# Altium schematic sheet Measurement.SchDoc: Measurement
size A3; DocumentNumber: 11; SheetNumber: 11; SheetTotal: 19
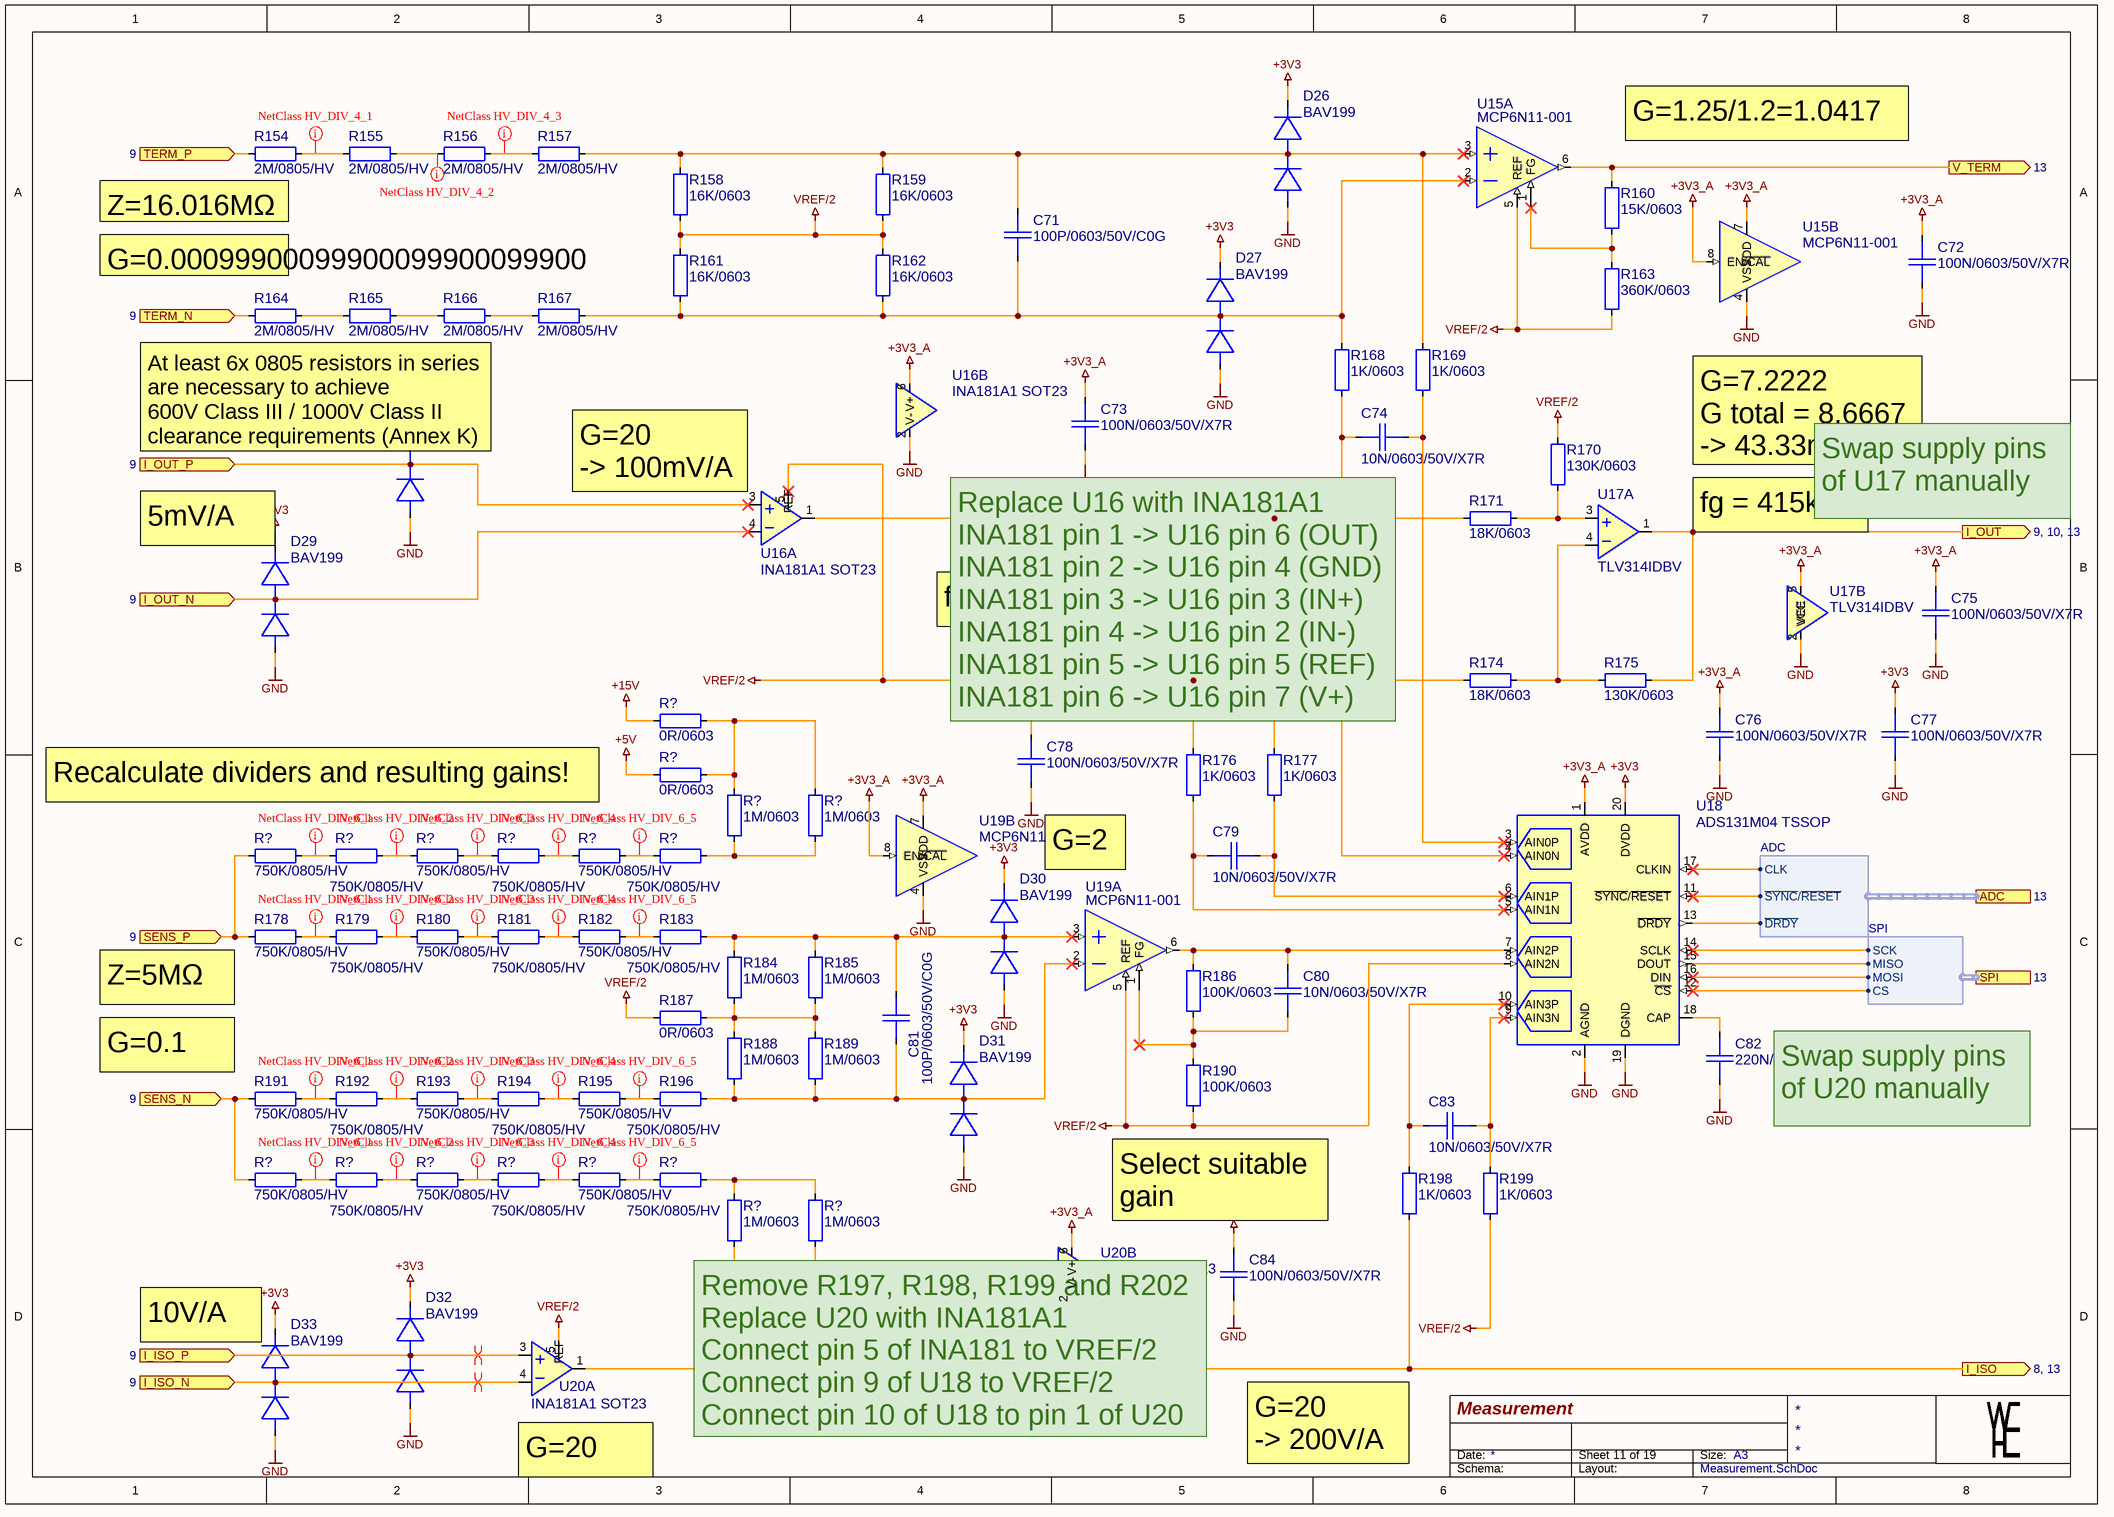
[diagram p0: Measurement.SchDoc]

## Parts
(Parts that share a designator on the sheet are numbered #1, #2 ... from top to bottom, then left to right.)
C71  100P/0603/50V/C0G  [CAP0603_C0G]
C72  100N/0603/50V/X7R  [CAP0603_X7R]
C73  100N/0603/50V/X7R  [CAP0603_X7R]
C74  10N/0603/50V/X7R  [CAP0603_X7R]
C75  100N/0603/50V/X7R  [CAP0603_X7R]
C76  100N/0603/50V/X7R  [CAP0603_X7R]
C77  100N/0603/50V/X7R  [CAP0603_X7R]
C78  100N/0603/50V/X7R  [CAP0603_X7R]
C79  10N/0603/50V/X7R  [CAP0603_X7R]
C80  10N/0603/50V/X7R  [CAP0603_X7R]
C81  100P/0603/50V/C0G  [CAP0603_C0G]
C82  220N/0603/25V/X7R  [CAP0603_X7R]
C83  10N/0603/50V/X7R  [CAP0603_X7R]
C84  100N/0603/50V/X7R  [CAP0603_X7R]
D26  BAV199  [SOT2395P280X125-3-SE]
D27  BAV199  [SOT2395P280X125-3-SE]
D28  BAV199  [SOT2395P280X125-3-SE]
D29  BAV199  [SOT2395P280X125-3-SE]
D30  BAV199  [SOT2395P280X125-3-SE]
D31  BAV199  [SOT2395P280X125-3-SE]
D32  BAV199  [SOT2395P280X125-3-SE]
D33  BAV199  [SOT2395P280X125-3-SE]
R154  2M/0805/HV  [R0805-0.50-HV-WW]
R155  2M/0805/HV  [R0805-0.50-HV-WW]
R156  2M/0805/HV  [R0805-0.50-HV-WW]
R157  2M/0805/HV  [R0805-0.50-HV-WW]
R158  16K/0603  [R0603-0.40-WW]
R159  16K/0603  [R0603-0.40-WW]
R160  15K/0603  [R0603-0.40-WW]
R161  16K/0603  [R0603-0.40-WW]
R162  16K/0603  [R0603-0.40-WW]
R163  360K/0603  [R0603-0.40-WW]
R164  2M/0805/HV  [R0805-0.50-HV-WW]
R165  2M/0805/HV  [R0805-0.50-HV-WW]
R166  2M/0805/HV  [R0805-0.50-HV-WW]
R167  2M/0805/HV  [R0805-0.50-HV-WW]
R168  1K/0603  [R0603-0.40-WW]
R169  1K/0603  [R0603-0.40-WW]
R170  130K/0603  [R0603-0.40-WW]
R171  18K/0603  [R0603-0.40-WW]
R174  18K/0603  [R0603-0.40-WW]
R175  130K/0603  [R0603-0.40-WW]
R176  1K/0603  [R0603-0.40-WW]
R177  1K/0603  [R0603-0.40-WW]
R178  750K/0805/HV  [R0805-0.50-HV-WW]
R179  750K/0805/HV  [R0805-0.50-HV-WW]
R180  750K/0805/HV  [R0805-0.50-HV-WW]
R181  750K/0805/HV  [R0805-0.50-HV-WW]
R182  750K/0805/HV  [R0805-0.50-HV-WW]
R183  750K/0805/HV  [R0805-0.50-HV-WW]
R184  1M/0603  [R0603-0.40-WW]
R185  1M/0603  [R0603-0.40-WW]
R186  100K/0603  [R0603-0.40-WW]
R187  0R/0603  [R0603-0.40-WW]
R188  1M/0603  [R0603-0.40-WW]
R189  1M/0603  [R0603-0.40-WW]
R190  100K/0603  [R0603-0.40-WW]
R191  750K/0805/HV  [R0805-0.50-HV-WW]
R192  750K/0805/HV  [R0805-0.50-HV-WW]
R193  750K/0805/HV  [R0805-0.50-HV-WW]
R194  750K/0805/HV  [R0805-0.50-HV-WW]
R195  750K/0805/HV  [R0805-0.50-HV-WW]
R196  750K/0805/HV  [R0805-0.50-HV-WW]
R198  1K/0603  [R0603-0.40-WW]
R199  1K/0603  [R0603-0.40-WW]
R?#1  0R/0603  [R0603-0.40-WW]
R?#2  0R/0603  [R0603-0.40-WW]
R?#3  1M/0603  [R0603-0.40-WW]
R?#4  1M/0603  [R0603-0.40-WW]
R?#5  750K/0805/HV  [R0805-0.50-HV-WW]
R?#6  750K/0805/HV  [R0805-0.50-HV-WW]
R?#7  750K/0805/HV  [R0805-0.50-HV-WW]
R?#8  750K/0805/HV  [R0805-0.50-HV-WW]
R?#9  750K/0805/HV  [R0805-0.50-HV-WW]
R?#10  750K/0805/HV  [R0805-0.50-HV-WW]
R?#11  750K/0805/HV  [R0805-0.50-HV-WW]
R?#12  750K/0805/HV  [R0805-0.50-HV-WW]
R?#13  750K/0805/HV  [R0805-0.50-HV-WW]
R?#14  750K/0805/HV  [R0805-0.50-HV-WW]
R?#15  750K/0805/HV  [R0805-0.50-HV-WW]
R?#16  750K/0805/HV  [R0805-0.50-HV-WW]
R?#17  1M/0603  [R0603-0.40-WW]
R?#18  1M/0603  [R0603-0.40-WW]
U15  MCP6N11-001  [SOP127P600X155-8-SW]  (parts A,B of 2)
U16  INA181A1 SOT23  [SOT2395P280X125-6-SE]  (parts A,B of 2)
U17  TLV314IDBV  [SOT2395P280X125-5-NW]  (parts A,B of 2)
U18  ADS131M04 TSSOP  [SOP065P640X120-20NW]
U19  MCP6N11-001  [SOP127P600X155-8-SW]  (parts A,B of 2)
U20  INA181A1 SOT23  [SOT2395P280X125-6-SE]  (parts A,B of 2)

## Ports
ADC (harness ADC, see 13), I_ISO (out, see 8, 13), I_ISO_N (in, see 9), I_ISO_P (in, see 9), I_OUT (out, see 9, 10, 13), I_OUT_N (in, see 9), I_OUT_P (in, see 9), SENS_N (in, see 9), SENS_P (in, see 9), SPI (harness SPI, see 13), TERM_N (in, see 9), TERM_P (in, see 9), V_TERM (out, see 13)

## Harnesses
ADC: CLK, ~{SYNC}/~{RESET}, ~{DRDY}
SPI: SCK, MISO, MOSI, CS

## Nets
+3V3: C77.1 D26.2(K2) D27.2(K2) D28.2(K2) D29.2(K2) D30.2(K2) D31.2(K2) D32.2(K2) D33.2(K2) U18.20(DVDD)
+3V3_A: C72.1 C73.1 C75.1 C76.1 C78.1 C84.1 U15.7(VDD) U15.8(EN/~{CAL}) U16.6(V+) U17.5(VCC) U18.1(AVDD) U19.7(VDD) U19.8(EN/~{CAL}) U20.6(V+)
+5V: R?#2.2
+15V: R?#1.2
GND: C72.2 C73.2 C75.2 C76.2 C77.2 C78.2 C82.2 C84.2 D26.1(A1) D27.1(A1) D28.1(A1) D29.1(A1) D30.1(A1) D31.1(A1) D32.1(A1) D33.1(A1) R?#17.2 R?#18.2 U15.4(VSS) U16.2(V-) U17.2(VEE) U18.2(AGND) U18.19(DGND) U19.4(VSS) U20.2(V-)
VREF/2: R158.2 R159.2 R161.1 R162.1 R163.2 R170.2 R174.1 R176.1 R187.2 R190.2 R199.2 U15.5(REF) U16.5(REF) U18.8(AIN2N) U19.5(REF) U20.5(REF)
I_ISO: R198.2 U20.1(OUT) ; port I_ISO
I_ISO_N: D33.3(K1/A2) U20.4(IN-) ; port I_ISO_N
I_ISO_P: D32.3(K1/A2) U20.3(IN+) ; port I_ISO_P
I_OUT: R175.2 U17.1(OUT) ; port I_OUT
I_OUT_N: D29.3(K1/A2) U16.4(IN-) ; port I_OUT_N
I_OUT_P: D28.3(K1/A2) U16.3(IN+) ; port I_OUT_P
SENS_N: R191.1 R?#11.1 ; port SENS_N
SENS_P: R178.1 R?#5.1 ; port SENS_P
TERM_N: R164.1 ; port TERM_N
TERM_P: R154.1 ; port TERM_P
V_TERM: R160.1 U15.6(Out) ; port V_TERM
NetC71_1: C71.1 D26.3(K1/A2) R157.1 R158.1 R159.1 R169.1 U15.3(+)
NetC71_2: C71.2 D27.3(K1/A2) R161.2 R162.2 R167.2 R168.1 U15.2(-)
NetC74_1: C74.1 R168.2 U18.4(AIN0N)
NetC74_2: C74.2 R169.2 U18.3(AIN0P)
NetC79_1: C79.1 R176.2 U18.5(AIN1N)
NetC79_2: C79.2 R177.2 U18.6(AIN1P)
NetC80_1: C80.1 R186.1 U18.7(AIN2P) U19.6(Out)
NetC80_2: C80.2 R186.2 R190.1 U19.1(FG)
NetC81_1: C81.1 D30.3(K1/A2) R183.2 R184.1 R185.1 U19.3(+)
NetC81_2: C81.2 D31.3(K1/A2) R188.2 R189.2 R196.2 U19.2(-)
NetC82_1: C82.1 U18.18(CAP)
NetC83_1: C83.1 R198.1 U18.10(AIN3P)
NetC83_2: C83.2 R199.1 U18.9(AIN3N)
NetR154_2: R154.2 R155.2
NetR155_1: R155.1 R156.1
NetR156_2: R156.2 R157.2
NetR160_2: R160.2 R163.1 U15.1(FG)
NetR164_2: R164.2 R165.1
NetR165_2: R165.2 R166.1
NetR166_2: R166.2 R167.1
NetR170_1: R170.1 R171.2 U17.3(IN+)
NetR171_1: R171.1 R177.1 U16.1(OUT)
NetR174_2: R174.2 R175.1 U17.4(IN-)
NetR178_2: R178.2 R179.1
NetR179_2: R179.2 R180.1
NetR180_2: R180.2 R181.1
NetR181_2: R181.2 R182.1
NetR182_2: R182.2 R183.1
NetR184_2: R184.2 R185.2 R187.1 R188.1 R189.1
NetR191_2: R191.2 R192.1
NetR192_2: R192.2 R193.1
NetR193_2: R193.2 R194.1
NetR194_2: R194.2 R195.1
NetR195_2: R195.2 R196.1
NetR?#1_1: R?#1.1 R?#2.1 R?#3.1 R?#4.1
NetR?#3_2: R?#3.2 R?#4.2 R?#10.2
NetR?#5_2: R?#5.2 R?#6.1
NetR?#6_2: R?#6.2 R?#7.1
NetR?#7_2: R?#7.2 R?#8.1
NetR?#8_2: R?#8.2 R?#9.1
NetR?#9_2: R?#9.2 R?#10.1
NetR?#11_2: R?#11.2 R?#12.1
NetR?#12_2: R?#12.2 R?#13.1
NetR?#13_2: R?#13.2 R?#14.1
NetR?#14_2: R?#14.2 R?#15.1
NetR?#15_2: R?#15.2 R?#16.1
NetR?#16_2: R?#16.2 R?#17.1 R?#18.1
NetU18_11: U18.11(~{SYNC}/~{RESET}) ; port ADC.~{SYNC}/~{RESET}
NetU18_12: U18.12(~{CS}) ; port SPI.CS
NetU18_13: U18.13(~{DRDY}) ; port ADC.~{DRDY}
NetU18_14: U18.14(SCLK) ; port SPI.SCK
NetU18_15: U18.15(DOUT) ; port SPI.MISO
NetU18_16: U18.16(DIN) ; port SPI.MOSI
NetU18_17: U18.17(CLKIN) ; port ADC.CLK

## Layout directives
net class HV_DIV_4_1: NetR154_2
net class HV_DIV_4_2: NetR155_1
net class HV_DIV_4_3: NetR156_2
net class HV_DIV_6_1: NetR178_2, NetR191_2, NetR?#5_2, NetR?#11_2
net class HV_DIV_6_2: NetR179_2, NetR192_2, NetR?#6_2, NetR?#12_2
net class HV_DIV_6_3: NetR180_2, NetR193_2, NetR?#7_2, NetR?#13_2
differential pair: I_ISO_N, I_ISO_P
net class HV_DIV_6_4: NetR181_2, NetR194_2, NetR?#8_2, NetR?#14_2
net class HV_DIV_6_5: NetR182_2, NetR195_2, NetR?#9_2, NetR?#15_2

## Notes on the sheet
- G=1.25/1.2=1.0417
- (near R154) Z=16.016MΩ
- (near R164) G=0.00099900099900099900099900
- (near D28) At least 6x 0805 resistors in series are necessary to achieve
  600V Class III / 1000V Class II clearance requirements (Annex K)
- (near U16) G=20
  -> 100mV/A
- G=7.2222
  G total = 8.6667
  -> 43.33mV/A
- Swap supply pins of U17 manually
- (near D29) 5mV/A
- fg = 415kHz
- fg = 417kHz
- Replace U16 with INA181A1
  INA181 pin 1 -> U16 pin 6 (OUT)
  INA181 pin 2 -> U16 pin 4 (GND)
  INA181 pin 3 -> U16 pin 3 (IN+)
  INA181 pin 4 -> U16 pin 2 (IN-)
  INA181 pin 5 -> U16 pin 5 (REF)
  INA181 pin 6 -> U16 pin 7 (V+)
- Recalculate dividers and resulting gains!
- G=2
- (near R178) Z=5MΩ
- (near R191) G=0.1
- Swap supply pins of U20 manually
- Select suitable gain
- (near D33) 10V/A
- (near U20) Remove R197, R198, R199 and R202
  Replace U20 with INA181A1
  Connect pin 5 of INA181 to VREF/2
  Connect pin 9 of U18 to VREF/2
  Connect pin 10 of U18 to pin 1 of U20
- G=20
  -> 200V/A
- (near U20) G=20
- Date:
- Size:
- A3
- Schema:
- Layout:

## Library data of the parts
C71 C81 = 100P/0603/50V/C0G: CAP SM 0603 100pF 50V C0G; Manufacturer: GENERIC; Manufacturer 1: YAGEO; Manufacturer Part Number 1: CC0603JRNPO9BN101; Absolute Value: 1E-10; Eurocircuits GPN: GPC0603101-C0G; Part Number: 100P/0603/50V/C0G; Package: 0603; Value: 100pF; HelpURL: https://www.yageo.com/upload/media/product/productsearch/datasheet/mlcc/UPY-GP_NP0_16V-to-50V_18.pdf; Supplier 1: Digi-Key; Supplier Part Number 1: 311-1069-1-ND; Manufacturer 2: YAGEO; Manufacturer Part Number 2: CC0603KRNPO9BN101; Supplier 2: Digi-Key; Supplier Part Number 2: 311-3600-1-ND; JLC Type: Basic; Manufacturer Part Number 3: CL10C101JB8NNNC; Supplier 3: LCSC; Supplier Part Number 3: C14858
C72 C73 C75-C78 C84 = 100N/0603/50V/X7R: CAP SM 0603 100nF 50V X7R; Manufacturer: GENERIC; Manufacturer 1: YAGEO; Manufacturer Part Number 1: CC0603KPX7R9BB104; Absolute Value: 1E-7; Eurocircuits GPN: GPC0603104; Part Number: 100N/0603/50V/X7R; Package: 0603; Value: 100nF; HelpURL: https://www.yageo.com/upload/media/product/app/datasheet/mlcc/upy-gphc_x7r_6_3v-to-250v.pdf; Supplier 1: Digi-Key; Supplier Part Number 1: 311-3567-1-ND; Supplier 3: LCSC; Supplier Part Number 3: C14663; Manufacturer 2: YAGEO; Manufacturer Part Number 2: CC0603MRX7R9BB104; Supplier 2: Digi-Key; Supplier Part Number 2: 311-4110-1-ND; JLC Type: Basic; Manufacturer Part Number 3: CC0603KRX7R9BB104
C74 C79 C80 C83 = 10N/0603/50V/X7R: CAP SM 0603 10nF 50V X7R; Manufacturer: GENERIC; Manufacturer 1: YAGEO; Manufacturer Part Number 1: CC0603KPX7R9BB103; Absolute Value: 1E-8; Eurocircuits GPN: GPC0603103; Part Number: 10N/0603/50V/X7R; Package: 0603; Value: 10nF; HelpURL: https://www.yageo.com/upload/media/product/app/datasheet/mlcc/upy-gphc_x7r_6_3v-to-250v.pdf; Supplier 1: Digi-Key; Supplier Part Number 1: 311-1572-1-ND; Manufacturer 2: YAGEO; Manufacturer Part Number 2: CC0603KRX7R9BB103; Supplier 2: Digi-Key; Supplier Part Number 2: 311-1085-1-ND; Manufacturer Part Number 3: CC0603KRX7R9BB103; Supplier 3: LCSC; Supplier Part Number 3: C100042
C82 = 220N/0603/25V/X7R: CAP SM 0603 220nF 25V X7R; Manufacturer: GENERIC; Absolute Value: 2.2E-7; Eurocircuits GPN: GPC0603; Part Number: 220N/0603/25V/X7R; Package: 0603; Value: 220nF; Supplier 3: LCSC; Supplier Part Number 3: C21120; JLC Type: Basic; Manufacturer Part Number 3: CL10B224KA8NNNC
D26-D33 = BAV199: Silicon Low Leakage Diode 85V; Manufacturer: Infineon Technologies; Manufacturer Part Number 1: BAV199E6433HTMA1; Part Number: BAV199; Package: SOT23; Value: BAV199; Absolute Value: 85V; HelpURL: https://www.infineon.com/dgdl/bav199series.pdf?folderId=db3a30431400ef6801141c748874044e&fileId=db3a30431400ef6801141cba733104e5; Manufacturer 1: Infineon Technologies; Supplier 1: Digikey; Supplier Part Number 1: BAV199E6433HTMA1CT-ND; Manufacturer 3: LRC; Manufacturer Part Number 3: LBAV199LT1G; Supplier 3: LCSC; Supplier Part Number 3: C12740
R154-R157 R164-R167 = 2M/0805/HV: RES SM 0805 2M High voltage; Manufacturer: GENERIC; Manufacturer 1: YAGEO; Manufacturer Part Number 1: RV0805FR-072ML; Absolute Value: 2000000; Part Number: 2M/0805/HV; Package: 0805; Value: 2M; HelpURL: https://www.yageogroup.com/content/datasheet/asset/file/PYU-RV_51_ROHS_L; Supplier 1: Digi-Key; Supplier Part Number 1: 13-RV0805FR-072MLCT-ND; Manufacturer 3: YAGEO; Manufacturer Part Number 3: RV0805FR-072ML; Supplier 3: LCSC; Supplier Part Number 3: C873372; JLC Type: Extended
R158 R159 R161 R162 = 16K/0603: RES SM 0603 16K; Manufacturer: GENERIC; Manufacturer 1: YAGEO; Manufacturer Part Number 1: RC0603FR-1316KL; Absolute Value: 16000; Eurocircuits GPN: GPR060316K; Part Number: 16K/0603; Package: 0603; Value: 16K; HelpURL: https://www.yageogroup.com/content/datasheet/asset/file/PYU-RC_GROUP_51_ROHS_L; Supplier 1: Digi-Key; Supplier Part Number 1: 13-RC0603FR-1316KLCT-ND; Manufacturer 2: YAGEO; Manufacturer Part Number 2: RC0603FR-1016KL; Supplier 2: Digi-Key; Supplier Part Number 2: 13-RC0603FR-1016KLCT-ND; JLC Type: Extended; Manufacturer 3: YAGEO; Manufacturer Part Number 3: RC0603FR-0716KL; Supplier 3: LCSC; Supplier Part Number 3: C137788
R160 = 15K/0603: RES SM 0603 15K; Manufacturer: GENERIC; Manufacturer 1: YAGEO; Manufacturer Part Number 1: RC0603FR-1315KL; Absolute Value: 15000; Eurocircuits GPN: GPR060315K; Part Number: 15K/0603; Package: 0603; Value: 15K; HelpURL: https://www.yageogroup.com/content/datasheet/asset/file/PYU-RC_GROUP_51_ROHS_L; Supplier 1: Digi-Key; Supplier Part Number 1: 13-RC0603FR-1315KLCT-ND; Manufacturer 2: YAGEO; Manufacturer Part Number 2: RC0603FR-1015KL; Supplier 2: Digi-Key; Supplier Part Number 2: 13-RC0603FR-1015KLCT-ND; Manufacturer 3: UNI-ROYAL(Uniroyal Elec); Manufacturer Part Number 3: 0603WAF1502T5E; Supplier 3: LCSC; Supplier Part Number 3: C22809; JLC Type: Basic
R163 = 360K/0603: RES SM 0603 360K; Manufacturer: GENERIC; Manufacturer 1: YAGEO; Manufacturer Part Number 1: RC0603FR-07360KL; Absolute Value: 360000; Eurocircuits GPN: GPR0603360K; Part Number: 360K/0603; Package: 0603; Value: 360K; HelpURL: https://www.yageogroup.com/content/datasheet/asset/file/PYU-RC_GROUP_51_ROHS_L; Supplier 1: Digi-Key; Supplier Part Number 1: 311-360KHRCT-ND; JLC Type: Extended; Manufacturer 3: UNI-ROYAL(Uniroyal Elec); Manufacturer Part Number 3: 0603WAF3603T5E; Supplier 3: LCSC; Supplier Part Number 3: C23146
R168 R169 R176 R177 R198 R199 = 1K/0603: RES SM 0603 1K; Manufacturer: GENERIC; Manufacturer 1: YAGEO; Manufacturer Part Number 1: RC0603FR-131KL; Absolute Value: 1000; Eurocircuits GPN: GPR06031K; Part Number: 1K/0603; Package: 0603; Value: 1K; HelpURL: https://www.yageogroup.com/content/datasheet/asset/file/PYU-RC_GROUP_51_ROHS_L; Supplier 1: Digi-Key; Supplier Part Number 1: 13-RC0603FR-131KLCT-ND; Manufacturer 2: YAGEO; Manufacturer Part Number 2: RC0603FR-101KL; Supplier 2: Digi-Key; Supplier Part Number 2: 13-RC0603FR-101KLCT-ND; Manufacturer 3: UNI-ROYAL(Uniroyal Elec); Manufacturer Part Number 3: 0603WAF1001T5E; Supplier 3: LCSC; Supplier Part Number 3: C21190; JLC Type: Basic
R170 R175 = 130K/0603: RES SM 0603 130K; Manufacturer: GENERIC; Manufacturer 1: YAGEO; Manufacturer Part Number 1: RC0603FR-07130KL; Absolute Value: 130000; Eurocircuits GPN: GPR0603130K; Part Number: 130K/0603; Package: 0603; Value: 130K; HelpURL: https://www.yageogroup.com/content/datasheet/asset/file/PYU-RC_GROUP_51_ROHS_L; Supplier 1: Digi-Key; Supplier Part Number 1: 311-130KHRCT-ND; JLC Type: Extended; Manufacturer 3: YAGEO; Manufacturer Part Number 3: RC0603FR-07130KL; Supplier 3: LCSC; Supplier Part Number 3: C163432
R171 R174 = 18K/0603: RES SM 0603 18K; Manufacturer: GENERIC; Manufacturer 1: YAGEO; Manufacturer Part Number 1: RC0603FR-1318KL; Absolute Value: 18000; Eurocircuits GPN: GPR060318K; Part Number: 18K/0603; Package: 0603; Value: 18K; HelpURL: https://www.yageogroup.com/content/datasheet/asset/file/PYU-RC_GROUP_51_ROHS_L; Supplier 1: Digi-Key; Supplier Part Number 1: 13-RC0603FR-1318KLCT-ND; Manufacturer 2: YAGEO; Manufacturer Part Number 2: RC0603FR-1018KL; Supplier 2: Digi-Key; Supplier Part Number 2: 13-RC0603FR-1018KLCT-ND; JLC Type: Basic; Manufacturer 3: UNI-ROYAL; Manufacturer Part Number 3: 0603WAF1802T5E; Supplier 3: LCSC; Supplier Part Number 3: C25810
R178-R183 R191-R196 R?#5-R?#16 = 750K/0805/HV: RES SM 0805 750K High voltage; Manufacturer: GENERIC; Manufacturer 1: YAGEO; Absolute Value: 750000; Part Number: 750K/0805/HV; Package: 0805; Value: 750K; HelpURL: https://www.yageogroup.com/content/datasheet/asset/file/PYU-RV_51_ROHS_L; Manufacturer 3: YAGEO; Manufacturer Part Number 3: RV0805FR-07750KL; Supplier 3: LCSC; Supplier Part Number 3: C873432; JLC Type: Extended
R184 R185 R188 R189 R?#3 R?#4 R?#17 R?#18 = 1M/0603: RES SM 0603 1M; Manufacturer: GENERIC; Manufacturer 1: YAGEO; Manufacturer Part Number 1: RC0603FR-131ML; Absolute Value: 1000000; Eurocircuits GPN: GPR06031M; Part Number: 1M/0603; Package: 0603; Value: 1M; HelpURL: https://www.yageogroup.com/content/datasheet/asset/file/PYU-RC_GROUP_51_ROHS_L; Supplier 1: Digi-Key; Supplier Part Number 1: 13-RC0603FR-131MLCT-ND; Manufacturer 2: YAGEO; Manufacturer Part Number 2: RC0603FR-101ML; Supplier 2: Digi-Key; Supplier Part Number 2: 13-RC0603FR-101MLCT-ND; JLC Type: Basic; Manufacturer 3: UNI-ROYAL(Uniroyal Elec); Manufacturer Part Number 3: 0603WAF1004T5E; Supplier 3: LCSC; Supplier Part Number 3: C22935
R186 R190 = 100K/0603: RES SM 0603 100K; Manufacturer: GENERIC; Manufacturer 1: YAGEO; Manufacturer Part Number 1: RC0603FR-13100KL; Absolute Value: 100000; Eurocircuits GPN: GPR0603100K; Part Number: 100K/0603; Package: 0603; Value: 100K; HelpURL: https://www.yageogroup.com/content/datasheet/asset/file/PYU-RC_GROUP_51_ROHS_L; Supplier 1: Digi-Key; Supplier Part Number 1: 13-RC0603FR-13100KLCT-ND; Manufacturer 2: YAGEO; Manufacturer Part Number 2: RC0603FR-10100KL; Supplier 2: Digi-Key; Supplier Part Number 2: 13-RC0603FR-10100KLCT-ND; JLC Type: Basic; Manufacturer 3: UNI-ROYAL(Uniroyal Elec); Manufacturer Part Number 3: 0603WAF1003T5E; Supplier 3: LCSC; Supplier Part Number 3: C25803
R187 R?#1 R?#2 = 0R/0603: RES SM 0603 0R; Manufacturer: GENERIC; Manufacturer 1: YAGEO; Manufacturer Part Number 1: RC0603FR-070RL; Absolute Value: 0; Eurocircuits GPN: GPR06030R; Part Number: 0R/0603; Package: 0603; Value: 0R; HelpURL: https://www.yageogroup.com/content/datasheet/asset/file/PYU-RC_GROUP_51_ROHS_L; Supplier 1: Digi-Key; Supplier Part Number 1: 311-0.0HRCT-ND; Manufacturer 2: YAGEO; Manufacturer Part Number 2: RC0603FR-130RL; Supplier 2: Digi-Key; Supplier Part Number 2: 13-RC0603FR-130RLCT-ND; Manufacturer 3: UNI-ROYAL(Uniroyal Elec); Manufacturer Part Number 3: 0603WAF0000T5E; Supplier 3: LCSC; Supplier Part Number 3: C21189; JLC Type: Basic
U15 U19 = MCP6N11-001 SO-8: MCP6N11-001 500 kHz, 800 μA Instrumentation Amplifier SO-8; Manufacturer: Microchip Technology; Manufacturer Part Number 1: MCP6N11-001E/SN; Part Number: MCP6N11-001 SO-8; Package: SO-8; HelpURL: https://ww1.microchip.com/downloads/en/DeviceDoc/25073A.pdf; Manufacturer 1: Microchip Technology; Supplier 1: Digi-Key; Supplier Part Number 1: MCP6N11-001E/SN-ND; Manufacturer 2: Microchip Technology; Manufacturer Part Number 2: MCP6N11T-001E/SN; Supplier 2: Digi-Key; Supplier Part Number 2: MCP6N11T-001E/SN-ND; Manufacturer 3: Microchip Tech; Manufacturer Part Number 3: MCP6N11T-001E/SN; Supplier 3: LCSC; Supplier Part Number 3: C623787
U16 U20 = INA181A1 SOT23: INA181A1, Bidirectional, Low- and High-Side Voltage Output, Current-Sense Amplifier, 20 V/V, SOT23; Manufacturer: Texas Instruments; Manufacturer Part Number 1: INA181A1IDBVR; Part Number: INA181A1 SOT23; Package: SOT23-6; HelpURL: https://www.ti.com/lit/ds/symlink/ina181.pdf; Manufacturer 1: Texas Instruments; Supplier 1: Digi-Key; Supplier Part Number 1: 296-47656-1-ND; Manufacturer 2: Texas Instruments; Manufacturer Part Number 2: INA181A1IDBVT; Supplier 2: Digi-Key; Supplier Part Number 2: 296-46634-1-ND; Manufacturer 3: Texas Instruments; Manufacturer Part Number 3: INA181A1IDBVR; Supplier 3: LCSC; Supplier Part Number 3: C2058943; Manufacturer 4: Texas Instruments; Manufacturer Part Number 4: INA181A1IDBVT; Supplier 4: LCSC; Supplier Part Number 4: C2861997; JLC Type: Extended
U17 = TLV314 SOT23: TLV314, 3-MHz, Low-Power, Internal EMI Filter, RRIO, Operational Amplifier; Manufacturer: Texas Instruments; Manufacturer Part Number 1: TLV314IDBVR; Part Number: TLV314 SOT23; Package: SOT23-5; HelpURL: https://www.ti.com/lit/ds/symlink/tlv4314.pdf; Manufacturer 1: Texas Instruments; Supplier 1: Digi-Key; Supplier Part Number 1: 296-46275-1-ND; Manufacturer 3: Texas Instruments; Manufacturer Part Number 3: TLV314IDBVR; Supplier 3: LCSC; Supplier Part Number 3: C133032; Manufacturer 2: Texas Instruments; Manufacturer Part Number 2: TLV314IDBVT; Supplier 2: Digi-Key; Supplier Part Number 2: 296-44110-2-ND
U18 = ADS131M04 TSSOP: ADS131M04 4-Channel, Simultaneously-Sampling, 24-Bit, Delta-Sigma ADC; Manufacturer: Texas Instruments; Manufacturer Part Number 1: ADS131M04IPWR; Part Number: ADS131M04 TSSOP; Package: TSSOP-20; HelpURL: https://www.ti.com/lit/ds/symlink/ads131m04.pdf; Manufacturer 1: Texas Instruments; Manufacturer 2: Texas Instruments; Manufacturer Part Number 2: ADS131M04IPWT; Supplier 1: Digi-Key; Supplier 2: Digi-Key; Supplier Part Number 1: 296-ADS131M04IPWRCT-ND; Supplier Part Number 2: 296-ADS131M04IPWTCT-ND; Manufacturer 3: Texas Instruments; Manufacturer Part Number 3: ADS131M04IPWR; Supplier 3: LCSC; Supplier Part Number 3: C2862562